# EAGLE schematic originaldimmer (EAGLE 9.1.0)
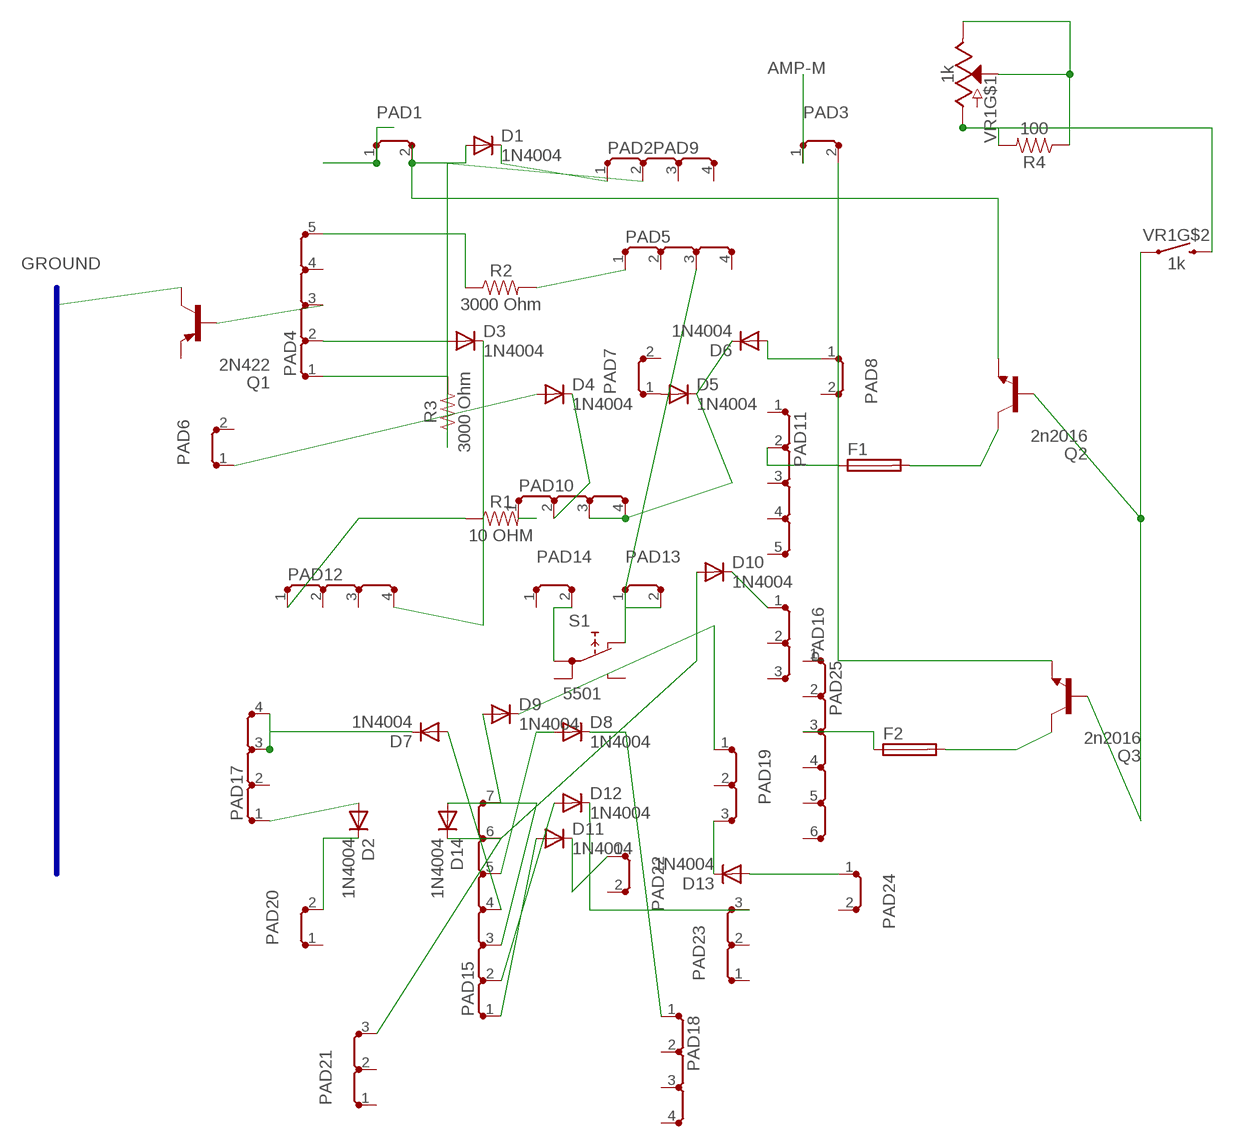
[diagram p0: schematic, sheet 1]

## Parts
D1  1N4004  [DO41-10]
D2  1N4004  [DO41-10]
D3  1N4004  [DO41-10]
D4  1N4004  [DO41-10]
D5  1N4004  [DO41-10]
D6  1N4004  [DO41-10]
D7  1N4004  [DO41-10]
D8  1N4004  [DO41-10]
D9  1N4004  [DO41-10]
D10  1N4004  [DO41-10]
D11  1N4004  [DO41-10]
D12  1N4004  [DO41-10]
D13  1N4004  [DO41-10]
D14  1N4004  [DO41-10]
F1  TR5  [TR5]
F2  TR5  [TR5]
PAD1  TE3/2  [TE3/2]
PAD2PAD9  TE3/4  [TE3/4]
PAD3  TE3/2  [TE3/2]
PAD4  TE3/5  [TE3/5]
PAD5  TE3/4  [TE3/4]
PAD6  TE3/2  [TE3/2]
PAD7  TE3/2  [TE3/2]
PAD8  TE3/2  [TE3/2]
PAD10  TE3/4  [TE3/4]
PAD11  TE3/5  [TE3/5]
PAD12  TE3/4  [TE3/4]
PAD13  TE3/2  [TE3/2]
PAD14  TE3/2  [TE3/2]
PAD15  TE3/7  [TE3/7]
PAD16  TE3/3  [TE3/3]
PAD17  TE3/4  [TE3/4]
PAD18  TE3/4  [TE3/4]
PAD19  TE3/3  [TE3/3]
PAD20  TE3/2  [TE3/2]
PAD21  TE3/3  [TE3/3]
PAD22  TE3/2  [TE3/2]
PAD23  TE3/3  [TE3/3]
PAD24  TE3/2  [TE3/2]
PAD25  TE3/6  [TE3/6]
Q1  2N422  2N4250A  [TO18]
Q2  2n2016  2N2102  [TO5]
Q3  2n2016  2N2102  [TO5]
R1  10 OHM  787OHM-0603-1/10W-1%  [0603]
R2  3000 Ohm  787OHM-0603-1/10W-1%  [0603]
R3  3000 Ohm  787OHM-0603-1/10W-1%  [0603]
R4  100  105OHM-0603-1/10W-1%  [0603]
S1  5501  [5501]
VR1  1k  POTENTIOMETER_W/SWITCHPOT_PTH_SWITCH  [POT-SWITCH-PTH]

## Nets
AMP-M: PAD3.1(P)
AMP-N: D1.A PAD1.2(P) Q2.1(E)
GROUND: Q1.3(C)
N$1: PAD4.3(P) Q1.2(B)
N$2: F2.1 PAD25.3(P)
N$3: F1.1 PAD11.2(P)
N$4: F1.2 Q2.3(C)
N$5: F2.2 Q3.3(C)
N$6: Q2.2(B) Q3.2(B) VR1.S1
N$7: R4.1 VR1.2(S) VR1.3(E)
N$8: PAD3.2(P) Q3.1(E)
N$9: D1.C PAD2PAD9.1(P)
N$11: D2.A PAD17.1(P)
N$12: D2.C PAD20.2(P)
N$13: PAD10.1(P) R1.2
N$14: PAD12.1(P) R1.1
N$15: PAD5.1(P) R2.2
N$16: PAD4.5(P) R2.1
N$17: PAD2PAD9.2(P) R3.1
N$18: PAD4.1(P) R3.2
N$19: D3.A PAD4.2(P)
N$20: D3.C PAD12.4(P)
N$21: D4.A PAD6.1(P)
N$22: D4.C PAD10.2(P)
N$23: D5.A PAD7.1(P)
N$24: D5.C D6.C PAD10.3(P) PAD10.4(P)
N$25: D6.A PAD8.1(P)
N$26: D7.A PAD15.4(P)
N$27: PAD1.1(P)
N$28: D8.A PAD15.5(P)
N$29: D8.C PAD18.1(P)
N$30: D9.A PAD15.7(P)
N$31: D9.C PAD19.1(P)
N$32: D10.C PAD16.1(P)
N$33: D10.A PAD15.6(P)
N$34: D11.A PAD15.1(P)
N$35: D11.C PAD22.1(P)
N$36: D12.C PAD23.3(P)
N$37: D12.A PAD15.2(P)
N$38: D13.A PAD24.1(P)
N$39: D13.C PAD19.3(P)
N$40: D14.A PAD15.3(P)
N$41: D14.C PAD21.3(P)
N$42: PAD5.3(P) PAD13.1(P)
N$44: R4.2 VR1.1(A) VR1.S2
N$45: D7.C PAD17.3(P) PAD17.4(P)
N$46: PAD14.2(P) S1.1A
N$47: PAD13.2(P) S1.NC
Unconnected: PAD2PAD9.3(P) PAD2PAD9.4(P) PAD4.4(P) PAD5.2(P) PAD5.4(P) PAD6.2(P) PAD7.2(P) PAD8.2(P) PAD11.1(P) PAD11.3(P) PAD11.4(P) PAD11.5(P) PAD12.2(P) PAD12.3(P) PAD14.1(P) PAD16.2(P) PAD16.3(P) PAD17.2(P) PAD18.2(P) PAD18.3(P) PAD18.4(P) PAD19.2(P) PAD20.1(P) PAD21.1(P) PAD21.2(P) PAD22.2(P) PAD23.1(P) PAD23.2(P) PAD24.2(P) PAD25.1(P) PAD25.2(P) PAD25.4(P) PAD25.5(P) PAD25.6(P) Q1.1(E) S1.1B S1.NO

## Buses
GROUND

## Library data of the parts
D1-D14 = diode:1N4004: DIODE general purpose rectifier, 1 A
F1 F2 = fuse:TR5: FUSE Wickmann; OC_FARNELL: unknown; OC_NEWARK: unknown
PAD1 PAD3 PAD6-PAD8 PAD13 PAD14 PAD20 PAD22 PAD24 = busbar:TE3/2: BUS BAR 2 connections, grid 3 TE
PAD2PAD9 PAD5 PAD10 PAD12 PAD17 PAD18 = busbar:TE3/4: BUS BAR 4 connections, grid 3 TE
PAD4 PAD11 = busbar:TE3/5: BUS BAR 5 connections, grid 3 TE
PAD15 = busbar:TE3/7: BUS BAR 7 connections, grid 3 TE
PAD16 PAD19 PAD21 PAD23 = busbar:TE3/3: BUS BAR 3 connections, grid 3 TE
PAD25 = busbar:TE3/6: BUS BAR 6 connections, grid 3 TE
Q1 = transistor-pnp:2N4250A: PNP Transistor
Q2 Q3 = transistor:2N2102: NPN TRANSISTOR
R1-R3 = SparkFun-Resistors:787OHM: 787Ω resistor A resistor is a passive two-terminal electrical component that implements electrical resistance as a circuit element. Resistors act to reduce current flow, and, at the same time, act to lower voltage levels within circuits. - Wikipedia; PROD_ID: RES-11228; VALUE: 787
R4 = SparkFun-Resistors:105OHM: 105Ω resistor A resistor is a passive two-terminal electrical component that implements electrical resistance as a circuit element. Resistors act to reduce current flow, and, at the same time, act to lower voltage levels within circuits. - Wikipedia; PROD_ID: RES-10751; VALUE: 105
S1 = switch:55?: PUSHBUTTON SERIES 5500 SWITCHES Source: www.e-switch.com .. 5500.pdf
VR1 = SparkFun-Resistors:POTENTIOMETER_W/SWITCH: Potentiometer (Pot) with Switch Three-terminal potentiometers, with an adjustable wiper and two adjustable resistors. A pot can be used to create a configurable voltage divider, or as a variable resistor. This potentiometer includes a "select" switch - actuated by pushing down on the wiper. Variants POT-SWITCH-PTH - 16mm PTH Pot w/ Switch Used on SparkFun FabFM Radio Kit <https://www.sparkfun.com/products/11043>; PROD_ID: RES-11300